# Altium project PinWheelV2.PrjPcb
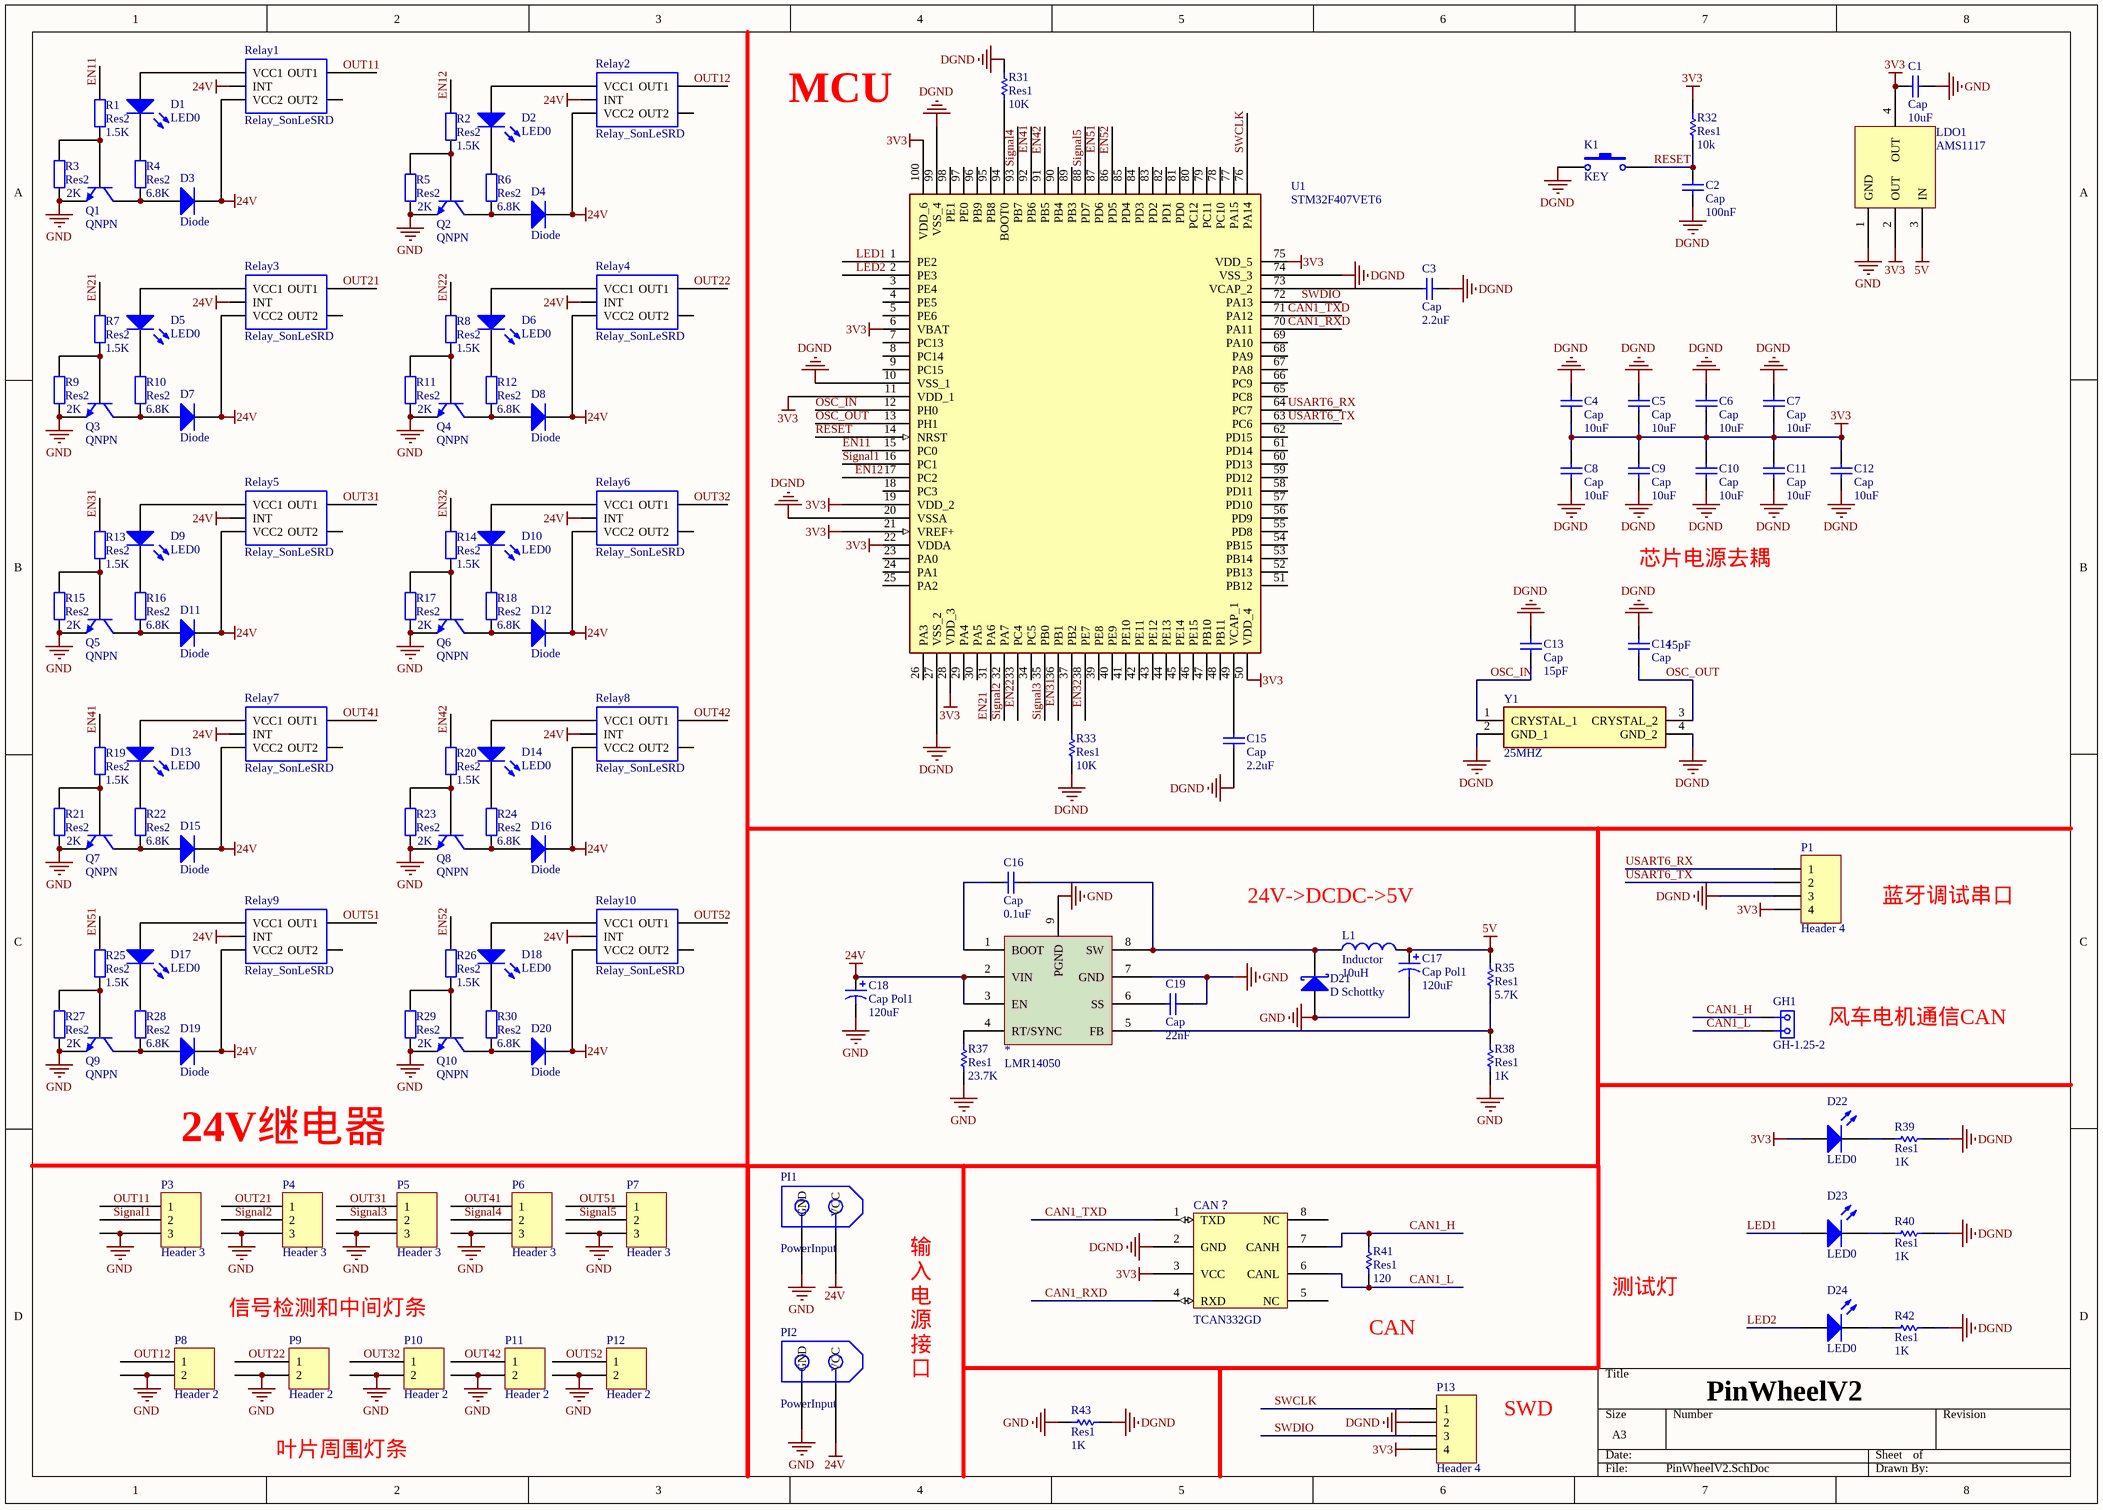
[diagram p0: PinWheelV2.SchDoc]
1 sheet, 126 parts. Net scope: global (net labels, ports and power ports of the same name join across sheets).
Board file: PinWheelV2.PcbDoc

## Sheet PinWheelV2.SchDoc
size A3

### Parts
*  LMR14050  [LMR14050]
C1  Cap  value 10uF  [R 0603]
C2  Cap  value 100nF  [R 0603]
C3  Cap  value 2.2uF  [R 0603]
C4  Cap  value 10uF  [R 0603]
C5  Cap  value 10uF  [R 0603]
C6  Cap  value 10uF  [R 0603]
C7  Cap  value 10uF  [R 0603]
C8  Cap  value 10uF  [R 0603]
C9  Cap  value 10uF  [R 0603]
C10  Cap  value 10uF  [R 0603]
C11  Cap  value 10uF  [R 0603]
C12  Cap  value 10uF  [R 0603]
C13  Cap  value 15pF  [R 0603]
C14  Cap  value 15pF  [R 0603]
C15  Cap  value 2.2uF  [R 0603]
C16  Cap  value 0.1uF  [R 0603]
C17  Cap Pol1  value 120uF  [Cap+8*11]
C18  Cap Pol1  value 120uF  [Cap+8*11]
C19  Cap  value 22nF  [R 0603]
CAN？  TCAN332GD  [LMR14050]
D1  LED0  [LED 0603]
D2  LED0  [LED 0603]
D3  Diode  [1N4007 D]
D4  Diode  [1N4007 D]
D5  LED0  [LED 0603]
D6  LED0  [LED 0603]
D7  Diode  [1N4007 D]
D8  Diode  [1N4007 D]
D9  LED0  [LED 0603]
D10  LED0  [LED 0603]
D11  Diode  [1N4007 D]
D12  Diode  [1N4007 D]
D13  LED0  [LED 0603]
D14  LED0  [LED 0603]
D15  Diode  [1N4007 D]
D16  Diode  [1N4007 D]
D17  LED0  [LED 0603]
D18  LED0  [LED 0603]
D19  Diode  [1N4007 D]
D20  Diode  [1N4007 D]
D21  D Schottky  [SMB]
D22  LED0  [LED 0603]
D23  LED0  [LED 0603]
D24  LED0  [LED 0603]
GH1  GH-1.25-2  [GH1.25_2P]
K1  KEY  [keySMD3.5*6]
L1  Inductor  value 10uH  [L 3.5*3*2.1]
LDO1  AMS1117  [AMS1117 3V3]
P1  Header 4  [HDR1X4]
P3  Header 3  [螺旋端子 3P3.81]
P4  Header 3  [螺旋端子 3P3.81]
P5  Header 3  [螺旋端子 3P3.81]
P6  Header 3  [螺旋端子 3P3.81]
P7  Header 3  [螺旋端子 3P3.81]
P8  Header 2  [螺旋端子 2P3.81]
P9  Header 2  [螺旋端子 2P3.81]
P10  Header 2  [螺旋端子 2P3.81]
P11  Header 2  [螺旋端子 2P3.81]
P12  Header 2  [螺旋端子 2P3.81]
P13  Header 4  [HDR1X4]
PI1  PowerInput  [XT30]
PI2  PowerInput  [XT30]
Q1  QNPN  [MMBT2222A]
Q2  QNPN  [MMBT2222A]
Q3  QNPN  [MMBT2222A]
Q4  QNPN  [MMBT2222A]
Q5  QNPN  [MMBT2222A]
Q6  QNPN  [MMBT2222A]
Q7  QNPN  [MMBT2222A]
Q8  QNPN  [MMBT2222A]
Q9  QNPN  [MMBT2222A]
Q10  QNPN  [MMBT2222A]
R1  Res2  value 1.5K  [R 0603]
R2  Res2  value 1.5K  [R 0603]
R3  Res2  value 2K  [R 0603]
R4  Res2  value 6.8K  [R 0603]
R5  Res2  value 2K  [R 0603]
R6  Res2  value 6.8K  [R 0603]
R7  Res2  value 1.5K  [R 0603]
R8  Res2  value 1.5K  [R 0603]
R9  Res2  value 2K  [R 0603]
R10  Res2  value 6.8K  [R 0603]
R11  Res2  value 2K  [R 0603]
R12  Res2  value 6.8K  [R 0603]
R13  Res2  value 1.5K  [R 0603]
R14  Res2  value 1.5K  [R 0603]
R15  Res2  value 2K  [R 0603]
R16  Res2  value 6.8K  [R 0603]
R17  Res2  value 2K  [R 0603]
R18  Res2  value 6.8K  [R 0603]
R19  Res2  value 1.5K  [R 0603]
R20  Res2  value 1.5K  [R 0603]
R21  Res2  value 2K  [R 0603]
R22  Res2  value 6.8K  [R 0603]
R23  Res2  value 2K  [R 0603]
R24  Res2  value 6.8K  [R 0603]
R25  Res2  value 1.5K  [R 0603]
R26  Res2  value 1.5K  [R 0603]
R27  Res2  value 2K  [R 0603]
R28  Res2  value 6.8K  [R 0603]
R29  Res2  value 2K  [R 0603]
R30  Res2  value 6.8K  [R 0603]
R31  Res1  value 10K  [R 0603]
R32  Res1  value 10k  [R 0603]
R33  Res1  value 10K  [R 0603]
R35  Res1  value 5.7K  [R 0603]
R37  Res1  value 23.7K  [R 0603]
R38  Res1  value 1K  [R 0603]
R39  Res1  value 1K  [R 0603]
R40  Res1  value 1K  [R 0603]
R41  Res1  value 120  [R 0603]
R42  Res1  value 1K  [R 0603]
R43  Res1  value 1K  [R 0603]
Relay1  Relay_SonLeSRD  [RePlay_SonLe]
Relay2  Relay_SonLeSRD  [RePlay_SonLe]
Relay3  Relay_SonLeSRD  [RePlay_SonLe]
Relay4  Relay_SonLeSRD  [RePlay_SonLe]
Relay5  Relay_SonLeSRD  [RePlay_SonLe]
Relay6  Relay_SonLeSRD  [RePlay_SonLe]
Relay7  Relay_SonLeSRD  [RePlay_SonLe]
Relay8  Relay_SonLeSRD  [RePlay_SonLe]
Relay9  Relay_SonLeSRD  [RePlay_SonLe]
Relay10  Relay_SonLeSRD  [RePlay_SonLe]
U1  STM32F407VET6  [STM32F407VET6]
Y1  25MHZ  [晶振 3.2*2.5]

### Nets
3V3: C1.2 C4.2 C5.2 C6.2 C7.2 C8.2 C9.2 C10.2 C11.2 C12.2 CAN？.3(VCC) D22.1(A) LDO1.2(OUT) LDO1.4(OUT) P1.4 P13.4 R32.2 U1.6(VBAT) U1.11(VDD_1) U1.19(VDD_2) U1.21(VREF+) U1.22(VDDA) U1.28(VDD_3) U1.50(VDD_4) U1.75(VDD_5) U1.100(VDD_6)
5V: C17.1 L1.2 LDO1.3(IN) R35.2
24V: *.2(VIN) *.3(EN) C18.1 D3.2(K) D4.2(K) D7.2(K) D8.2(K) D11.2(K) D12.2(K) D15.2(K) D16.2(K) D19.2(K) D20.2(K) PI1.1(VCC) PI2.1(VCC) Relay1.4(VCC2) Relay1.5(INT) Relay2.4(VCC2) Relay2.5(INT) Relay3.4(VCC2) Relay3.5(INT) Relay4.4(VCC2) Relay4.5(INT) Relay5.4(VCC2) Relay5.5(INT) Relay6.4(VCC2) Relay6.5(INT) Relay7.4(VCC2) Relay7.5(INT) Relay8.4(VCC2) Relay8.5(INT) Relay9.4(VCC2) Relay9.5(INT) Relay10.4(VCC2) Relay10.5(INT)
DGND: C2.1 C3.2 C4.1 C5.1 C6.1 C7.1 C8.1 C9.1 C10.1 C11.1 C12.1 C13.2 C14.2 C15.1 CAN？.2(GND) K1.1 P1.3 P13.2 R31.2 R33.1 R39.2 R40.2 R42.2 R43.2 U1.10(VSS_1) U1.20(VSSA) U1.27(VSS_2) U1.74(VSS_3) U1.99(VSS_4) Y1.2(GND_1) Y1.4(GND_2)
GND: *.7(GND) *.9(PGND) C1.1 C17.2 C18.2 C19.2 D21.1(A) LDO1.1(GND) P3.3 P4.3 P5.3 P6.3 P7.3 P8.2 P9.2 P10.2 P11.2 P12.2 PI1.2(GND) PI2.2(GND) Q1.3(E) Q2.3(E) Q3.3(E) Q4.3(E) Q5.3(E) Q6.3(E) Q7.3(E) Q8.3(E) Q9.3(E) Q10.3(E) R3.1 R5.1 R9.1 R11.1 R15.1 R17.1 R21.1 R23.1 R27.1 R29.1 R37.1 R38.1 R43.1
CAN1_H: CAN？.7(CANH) GH1.1 R41.2
CAN1_L: CAN？.6(CANL) GH1.2 R41.1
CAN1_RXD: CAN？.4(RXD) U1.70(PA11)
CAN1_TXD: CAN？.1(TXD) U1.71(PA12)
EN11: R1.2 U1.15(PC0)
EN12: R2.2 U1.17(PC2)
EN21: R7.2 U1.31(PA6)
EN22: R8.2 U1.33(PC4)
EN31: R13.2 U1.36(PB1)
EN32: R14.2 U1.38(PE7)
EN41: R19.2 U1.92(PB6)
EN42: R20.2 U1.91(PB5)
EN51: R25.2 U1.87(PD6)
EN52: R26.2 U1.86(PD5)
LED1: D23.1(A) U1.1(PE2)
LED2: D24.1(A) U1.2(PE3)
OSC_IN: C13.1 U1.12(PH0) Y1.1(CRYSTAL_1)
OSC_OUT: C14.1 U1.13(PH1) Y1.3(CRYSTAL_2)
OUT11: P3.1 Relay1.1(OUT1)
OUT12: P8.1 Relay2.1(OUT1)
OUT21: P4.1 Relay3.1(OUT1)
OUT22: P9.1 Relay4.1(OUT1)
OUT31: P5.1 Relay5.1(OUT1)
OUT32: P10.1 Relay6.1(OUT1)
OUT41: P6.1 Relay7.1(OUT1)
OUT42: P11.1 Relay8.1(OUT1)
OUT51: P7.1 Relay9.1(OUT1)
OUT52: P12.1 Relay10.1(OUT1)
RESET: C2.2 K1.2 R32.1 U1.14(NRST)
Signal1: P3.2 U1.16(PC1)
Signal2: P4.2 U1.32(PA7)
Signal3: P5.2 U1.35(PB0)
Signal4: P6.2 U1.93(PB7)
Signal5: P7.2 U1.88(PD7)
SWCLK: P13.1 U1.76(PA14)
SWDIO: P13.3 U1.72(PA13)
USART6_RX: P1.1 U1.64(PC7)
USART6_TX: P1.2 U1.63(PC6)
Net*_1: *.1(BOOT) C16.1
Net*_4: *.4(RT/SYNC) R37.2
Net*_5: *.5(FB) R35.1 R38.2
Net*_6: *.6(SS) C19.1
Net*_8: *.8(SW) C16.2 D21.2(K) L1.1
NetC3_1: C3.1 U1.73(VCAP_2)
NetC15_2: C15.2 U1.49(VCAP_1)
NetD1_1: D1.1(A) Relay1.3(VCC1)
NetD1_2: D1.2(K) R4.2
NetD2_1: D2.1(A) Relay2.3(VCC1)
NetD2_2: D2.2(K) R6.2
NetD3_1: D3.1(A) Q1.1(C) R4.1
NetD4_1: D4.1(A) Q2.1(C) R6.1
NetD5_1: D5.1(A) Relay3.3(VCC1)
NetD5_2: D5.2(K) R10.2
NetD6_1: D6.1(A) Relay4.3(VCC1)
NetD6_2: D6.2(K) R12.2
NetD7_1: D7.1(A) Q3.1(C) R10.1
NetD8_1: D8.1(A) Q4.1(C) R12.1
NetD9_1: D9.1(A) Relay5.3(VCC1)
NetD9_2: D9.2(K) R16.2
NetD10_1: D10.1(A) Relay6.3(VCC1)
NetD10_2: D10.2(K) R18.2
NetD11_1: D11.1(A) Q5.1(C) R16.1
NetD12_1: D12.1(A) Q6.1(C) R18.1
NetD13_1: D13.1(A) Relay7.3(VCC1)
NetD13_2: D13.2(K) R22.2
NetD14_1: D14.1(A) Relay8.3(VCC1)
NetD14_2: D14.2(K) R24.2
NetD15_1: D15.1(A) Q7.1(C) R22.1
NetD16_1: D16.1(A) Q8.1(C) R24.1
NetD17_1: D17.1(A) Relay9.3(VCC1)
NetD17_2: D17.2(K) R28.2
NetD18_1: D18.1(A) Relay10.3(VCC1)
NetD18_2: D18.2(K) R30.2
NetD19_1: D19.1(A) Q9.1(C) R28.1
NetD20_1: D20.1(A) Q10.1(C) R30.1
NetD22_2: D22.2(K) R39.1
NetD23_2: D23.2(K) R40.1
NetD24_2: D24.2(K) R42.1
NetQ1_2: Q1.2(B) R1.1 R3.2
NetQ2_2: Q2.2(B) R2.1 R5.2
NetQ3_2: Q3.2(B) R7.1 R9.2
NetQ4_2: Q4.2(B) R8.1 R11.2
NetQ5_2: Q5.2(B) R13.1 R15.2
NetQ6_2: Q6.2(B) R14.1 R17.2
NetQ7_2: Q7.2(B) R19.1 R21.2
NetQ8_2: Q8.2(B) R20.1 R23.2
NetQ9_2: Q9.2(B) R25.1 R27.2
NetQ10_2: Q10.2(B) R26.1 R29.2
NetR31_1: R31.1 U1.94(BOOT0)
NetR33_2: R33.2 U1.37(PB2)

Not connected (* = marked no-connect by the designer): CAN？ 5(NC) 8(NC); Relay1 2(OUT2); Relay2 2(OUT2); Relay3 2(OUT2); Relay4 2(OUT2); Relay5 2(OUT2); Relay6 2(OUT2); Relay7 2(OUT2); Relay8 2(OUT2); Relay9 2(OUT2); Relay10 2(OUT2); U1 3(PE4) 4(PE5) 5(PE6) 7(PC13) 8(PC14) 9(PC15) 18(PC3) 23(PA0) 24(PA1) 25(PA2) 26(PA3) 29(PA4) 30(PA5) 34(PC5) 39(PE8) 40(PE9) 41(PE10) 42(PE11) 43(PE12) 44(PE13) 45(PE14) 46(PE15) 47(PB10) 48(PB11) 51(PB12) 52(PB13) 53(PB14) 54(PB15) 55(PD8) 56(PD9) 57(PD10) 58(PD11) 59(PD12) 60(PD13) 61(PD14) 62(PD15) 65(PC8) 66(PC9) 67(PA8) 68(PA9) 69(PA10) 77(PA15) 78(PC10) 79(PC11) 80(PC12) 81(PD0) 82(PD1) 83(PD2) 84(PD3) 85(PD4) 89(PB3) 90(PB4) 95(PB8) 96(PB9) 97(PE0) 98(PE1)

### Notes on the sheet
- MCU
- 芯片电源去耦
- 24V->DCDC->5V
- 蓝牙调试串口
- 风车电机通信CAN
- 24V继电器
- 信号检测和中间灯条
- 测试灯
- 输入电源接口
- (near R41) CAN
- SWD
- PinWheelV2
- 叶片周围灯条

### Library data of the parts
C1-C16 C19 = Cap: Capacitor; Published: 8-Jun-2000; LatestRevisionDate: 17-Jul-2002; LatestRevisionNote: Re-released for DXP Platform.; PackageReference: RAD-0.3; Publisher: Altium Limited; PackageDescription: Radial Cap, Thru-Hole; 2 Leads; 0.3 in Pin Spacing
C17 C18 = Cap Pol1: Polarized Capacitor (Radial); Published: 8-Jun-2000; LatestRevisionDate: 17-Jul-2002; LatestRevisionNote: Re-released for DXP Platform.; PackageReference: RB7.6-15; Publisher: Altium Limited; PackageDescription: Polarized Capacitor (Radial); 2 Leads
D1 D2 D5 D6 D9 D10 D13 D14 D17 D18 D22-D24 = LED0: Typical INFRARED GaAs LED; Published: 8-Jun-2000; LatestRevisionDate: 08-Jul-2005; LatestRevisionNote: Mech Layer 1 removed.; PackageReference: LED-0; Publisher: Altium Limited; PackageDescription: LED; 2 Leads
D3 D4 D7 D8 D11 D12 D15 D16 D19 D20 = Diode: Default Diode; Published: 8-Jun-2000; LatestRevisionDate: 17-Jul-2002; LatestRevisionNote: Re-released for DXP Platform.; PackageVersion: Sep-1996; PackageReference: SMC; Publisher: Altium Limited; PackageDescription: DO-214-AB/SMC; 2 C-Bend Leads; Body 7.9 x 5.9 mm, inc. leads (LxW); Code_JEDEC: DO-214-AB
D21 = D Schottky: Schottky Diode; Published: 8-Jun-2000; LatestRevisionDate: 17-Jul-2002; LatestRevisionNote: Re-released for DXP Platform.; PackageReference: SMB; Publisher: Altium Limited; PackageDescription: DO-214-AA/SMB; 2 C-Bend Leads; Body 5.3 x 3.6 mm, inc. leads (LxW); Code_JEDEC: DO-214-AA
L1 = Inductor: Code_IEC: 1005; Published: 8-Jun-2000; LatestRevisionDate: 29-May-2009; LatestRevisionNote: IPC-7351 Footprint Added.; PackageReference: 0402-A; Publisher: Altium Limited; PackageDescription: Chip Inductor; Code_JEITA: 0402
P1 P13 = Header 4: Header, 4-Pin; LatestRevisionDate: 17-Jul-2002; LatestRevisionNote: Re-released for DXP Platform.; Publisher: Altium Limited
P3-P7 = Header 3: Header, 3-Pin; LatestRevisionDate: 17-Jul-2002; LatestRevisionNote: Re-released for DXP Platform.; Publisher: Altium Limited
P8-P12 = Header 2: Header, 2-Pin; LatestRevisionDate: 17-Jul-2002; LatestRevisionNote: Re-released for DXP Platform.; Publisher: Altium Limited
Q1-Q10 = QNPN: NPN Bipolar Transistor; Published: 8-Jun-2000; LatestRevisionDate: 29-May-2009; LatestRevisionNote: IPC-7351 Footprint Added.; PackageVersion: Aug-1999; PackageReference: SOT-23B; Publisher: Altium Limited; PackageDescription: 3-Pin SOT-23 Package 0.95 mm Pitch, 2.4 mm Lead Span
R1-R30 = Res2: Resistor; Published: 8-Jun-2000; LatestRevisionDate: 17-Jul-2002; LatestRevisionNote: Re-released for DXP Platform.; PackageReference: AXIAL-0.4; Publisher: Altium Limited; PackageDescription: Axial Device, Thru-Hole; 2 Leads; 0.4 in Pin Spacing
R31-R33 R35 R37-R43 = Res1: Resistor; Published: 8-Jun-2000; LatestRevisionDate: 17-Jul-2002; LatestRevisionNote: Re-released for DXP Platform.; PackageReference: AXIAL-0.3; Publisher: Altium Limited; PackageDescription: Axial Device, Thru-Hole; 2 Leads; 0.3 in Pin Spacing
Y1 = ABM11AIG-25.000MHZ-4Z-T3: Crystal or Oscillator; Manufacturer_Name: ABRACON; Datasheet Link: https://componentsearchengine.com/Datasheets/1/ABM11AIG-25.000MHZ-4Z-T3.pdf; Height: 0.55mm; Mouser Part Number: 815-M11AIG-25-4ZT3; Mouser Price/Stock: https://www.mouser.com/Search/Refine.aspx?Keyword=815-M11AIG-25-4ZT3; Manufacturer_Part_Number: ABM11AIG-25.000MHZ-4Z-T3